# EAGLE design PGTN021_octasource_mkiii_panel_b (EAGLE 9.6.0)
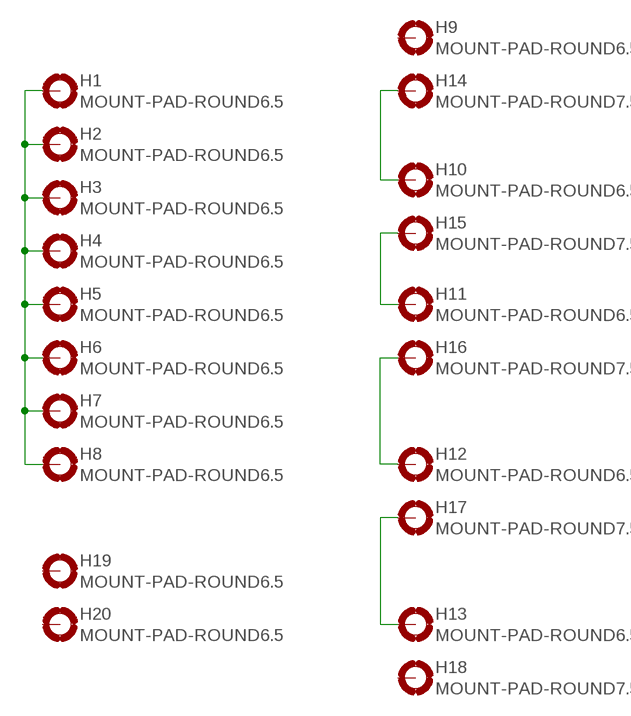
[diagram p0: schematic, sheet 1]

## Parts
H1  MOUNT-PAD-ROUND6.5  [6.5-PAD]
H2  MOUNT-PAD-ROUND6.5  [6.5-PAD]
H3  MOUNT-PAD-ROUND6.5  [6.5-PAD]
H4  MOUNT-PAD-ROUND6.5  [6.5-PAD]
H5  MOUNT-PAD-ROUND6.5  [6.5-PAD]
H6  MOUNT-PAD-ROUND6.5  [6.5-PAD]
H7  MOUNT-PAD-ROUND6.5  [6.5-PAD]
H8  MOUNT-PAD-ROUND6.5  [6.5-PAD]
H9  MOUNT-PAD-ROUND6.5  [6.5-PAD]
H10  MOUNT-PAD-ROUND6.5  [6.5-PAD]
H11  MOUNT-PAD-ROUND6.5  [6.5-PAD]
H12  MOUNT-PAD-ROUND6.5  [6.5-PAD]
H13  MOUNT-PAD-ROUND6.5  [6.5-PAD]
H14  MOUNT-PAD-ROUND7.5  [7.5-PAD]
H15  MOUNT-PAD-ROUND7.5  [7.5-PAD]
H16  MOUNT-PAD-ROUND7.5  [7.5-PAD]
H17  MOUNT-PAD-ROUND7.5  [7.5-PAD]
H18  MOUNT-PAD-ROUND7.5  [7.5-PAD]
H19  MOUNT-PAD-ROUND6.5  [6.5-PAD]
H20  MOUNT-PAD-ROUND6.5  [6.5-PAD]

## Nets
N$2: H1.B6.5(MOUNT) H2.B6.5(MOUNT) H3.B6.5(MOUNT) H4.B6.5(MOUNT) H5.B6.5(MOUNT) H6.B6.5(MOUNT) H7.B6.5(MOUNT) H8.B6.5(MOUNT)
N$4: H10.B6.5(MOUNT) H14.B7.5(MOUNT)
N$5: H11.B6.5(MOUNT) H15.B7.5(MOUNT)
N$7: H12.B6.5(MOUNT) H16.B7.5(MOUNT)
N$8: H13.B6.5(MOUNT) H17.B7.5(MOUNT)
Unconnected: H9.B6.5(MOUNT) H18.B7.5(MOUNT) H19.B6.5(MOUNT) H20.B6.5(MOUNT)

## Library data of the parts
H1-H20 = holes:MOUNT-PAD-ROUND: MOUNTING PAD, round

## Board
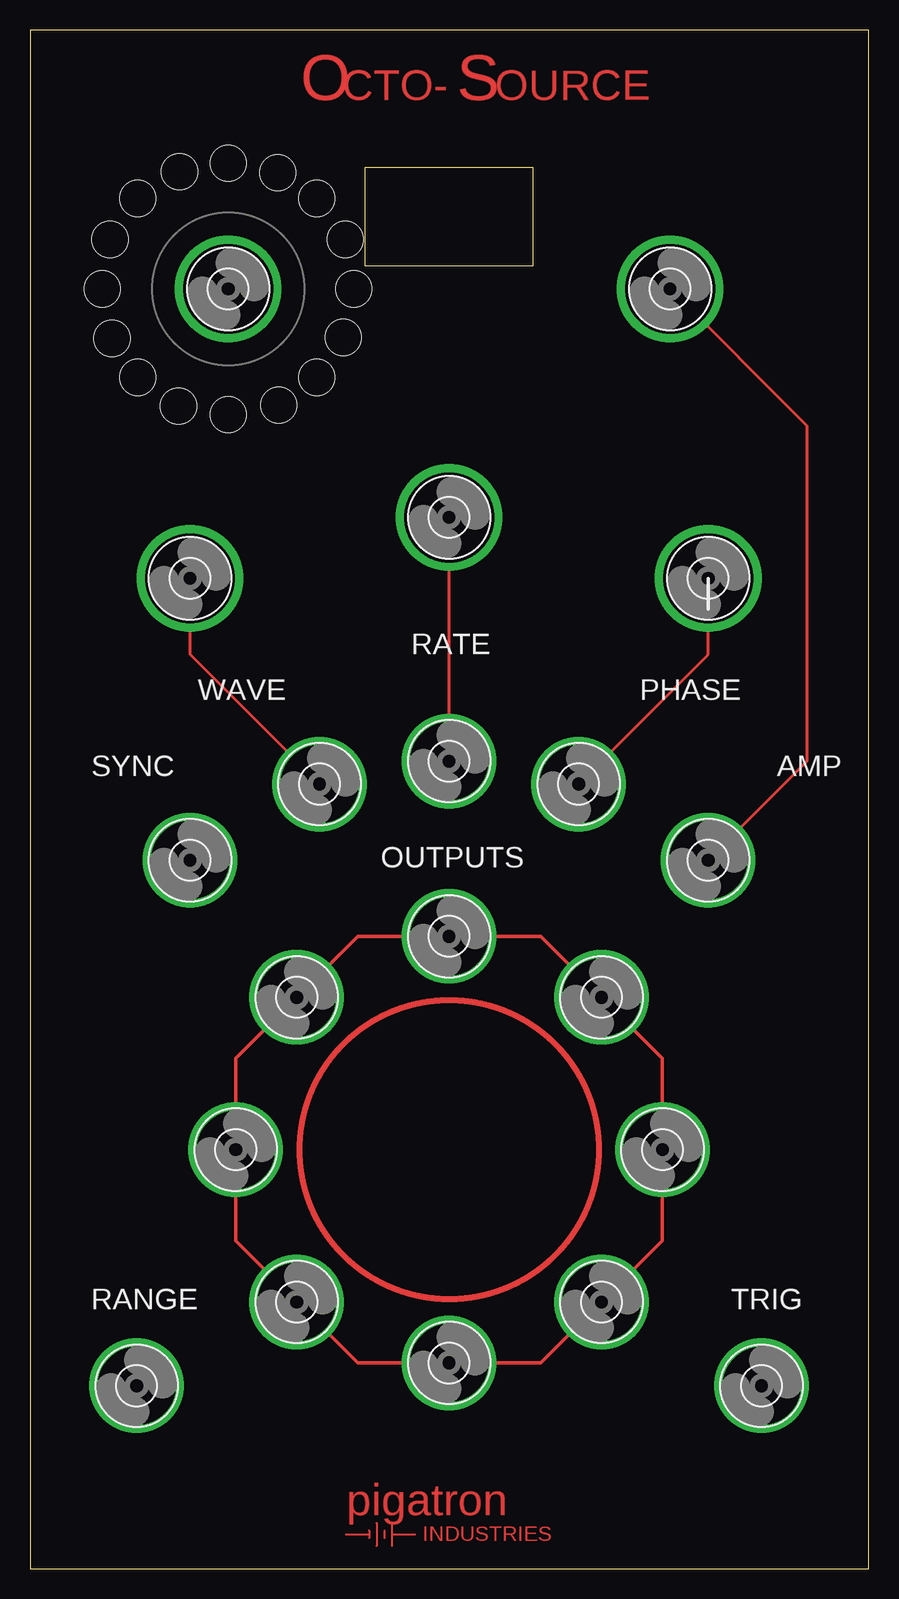
[diagram p1: board, top side]

Size 69.9 x 128.26 mm. Coordinates in mm from the lower left corner, seen from the top.
Outline: 0,0 69.9,0 69.9,128.26 0,128.26 0,0
Outline: 27.94,116.84 41.91,116.84 41.91,108.58 27.94,108.58 27.94,116.84
Copper layers (1*16): Top 0.0356mm / dielectric 1.5011mm / Bottom 0.0356mm
Design rules "pigatron *": minimum track width 5mil, minimum drill 13mil, track to track 8mil, track to pad 8mil, pad to pad 8mil, via to via 8mil, smd to smd 6mil, copper to edge 10mil, drill to drill 10mil, minimum pad ring 6mil, minimum via ring 10mil, stop-mask expansion 4mil, vias tented up to drill 15mil, thermal gap 10mil
Holes 3 mm at 16.51,96.2 20.72,97 23.89,99.3 26.11,102.63 26.99,106.68 26.27,110.81 23.89,114.22 20.64,116.36 16.51,117.16 12.46,116.44 8.97,114.22 6.67,110.81 6.03,106.68 6.83,102.55 8.97,99.3 12.38,96.92

### Footprints (pad centres in the part's own frame; a part is rotated, then mirrored left to right if it is on the bottom)
6.5-PAD = drill 6.502 pad 7.874: B6.5 0,0
7.5-PAD = drill 7.493 pad 8.89: B7.5 0,0

### Placement (x,y rotation side)
H1  34.92,52.7 0 top
H2  47.62,47.62 0 top
H3  52.7,34.92 0 top
H4  47.62,22.23 0 top
H5  34.92,17.15 0 top
H6  22.23,22.23 0 top
H7  17.14,34.92 0 top
H8  22.23,47.62 0 top
H9  13.34,59.05 0 top
H10  24.13,65.41 0 top
H11  34.92,67.31 0 top
H12  45.72,65.41 0 top
H13  56.52,59.05 0 top
H14  13.34,82.55 0 top
H15  34.92,87.63 0 top
H16  56.52,82.55 0 top
H17  53.34,106.68 0 top
H18  16.51,106.68 0 top
H19  60.96,15.24 0 top
H20  8.89,15.24 0 top
U$2  [PIGATRON-LOGO-TRACE]  35.24,4.45 0 top

### Tracks (layer width: path | path; a pad name or v marks a point on that pad's centre or on a via)
N$2
  Top 0.305: H7.B6.5 17.14,35.56 17.14,42.55 H8.B6.5 27.3,52.7 H1.B6.5 42.55,52.7 H2.B6.5 52.7,42.55 H3.B6.5 52.7,27.3 H4.B6.5 42.55,17.15 H5.B6.5 27.3,17.15 H6.B6.5 17.14,27.3 H7.B6.5
N$4
  Top 0.254: H10.B6.5 13.34,76.2 H14.B7.5
N$5
  Top 0.254: H11.B6.5 H15.B7.5
N$7
  Top 0.254: H12.B6.5 56.52,76.2 H16.B7.5
N$8
  Top 0.254: H17.B7.5 64.77,95.25 64.77,67.31 H13.B6.5
(copper drawn outside any net)
  shapes: Top circle x1

### Text on the board
Top: O | CTO- | S | OURCE
tNames: RATE | WAVE | PHASE | SYNC | AMP | OUTPUTS | RANGE | TRIG
bNames: Rob Ellis 2021
tStop: O | CTO- | S | OURCE